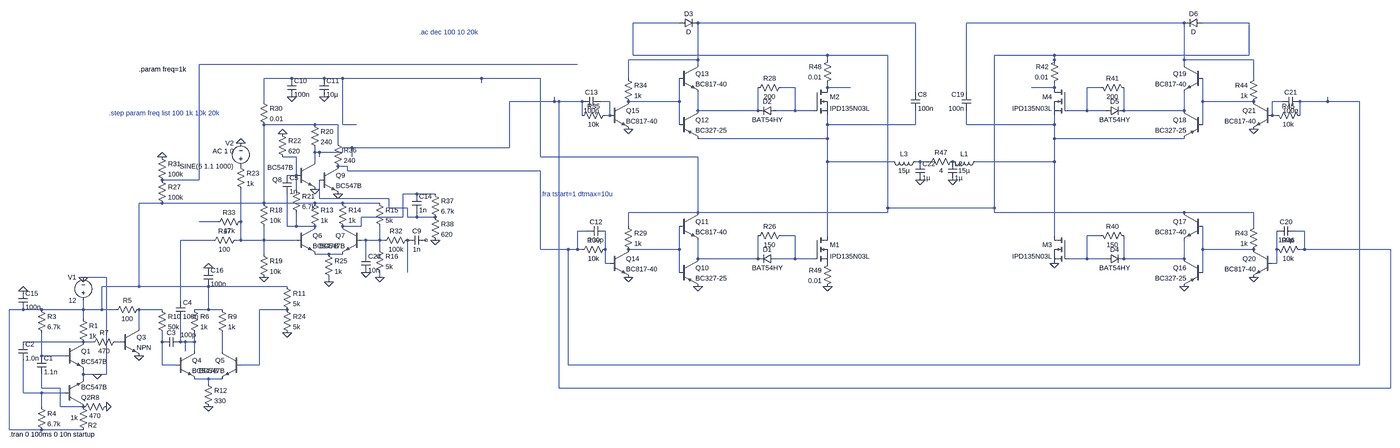
[diagram p0: schematic ClassDAmp.asc, whole sheet]
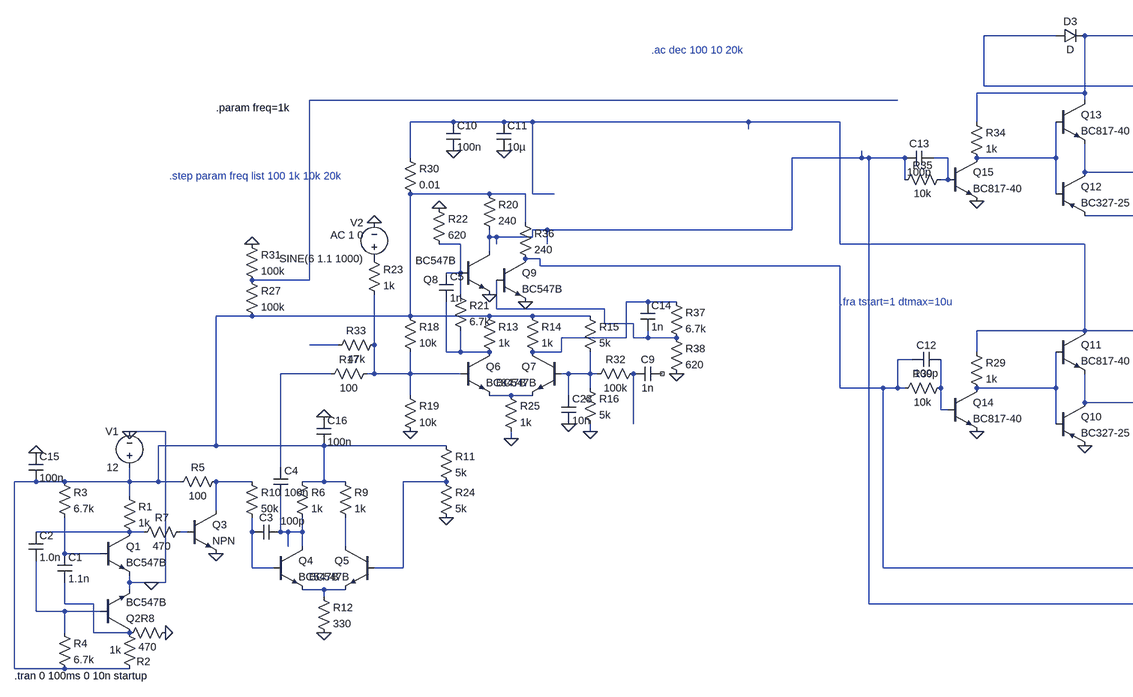
[diagram p1: schematic ClassDAmp.asc, part, row 1 of 1, column 1 of 2]
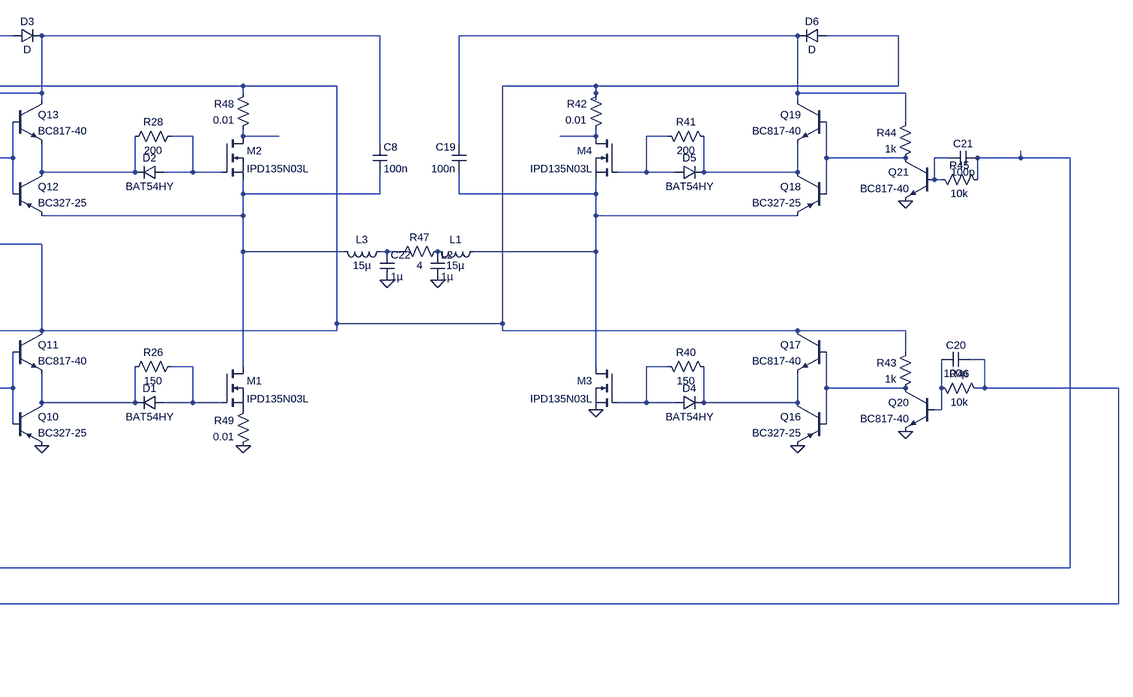
[diagram p2: schematic ClassDAmp.asc, part, row 1 of 1, column 2 of 2]
ClassDAmp.asc, the LTspice schematic file:
Version 4.1
SHEET 1 4820 680
WIRE 2160 -992 2000 -992
WIRE 2976 -992 2224 -992
WIRE 3904 -992 3152 -992
WIRE 4128 -992 3968 -992
WIRE 2000 -880 2000 -992
WIRE 2672 -880 2000 -880
WIRE 2880 -880 2672 -880
WIRE 3456 -880 3248 -880
WIRE 4128 -880 4128 -992
WIRE 4128 -880 3456 -880
WIRE 2224 -864 2224 -992
WIRE 2224 -864 1984 -864
WIRE 2672 -864 2672 -880
WIRE 3456 -864 3456 -880
WIRE 3904 -864 3904 -992
WIRE 4144 -864 3904 -864
WIRE 1808 -848 496 -848
WIRE 2224 -848 2224 -864
WIRE 3456 -848 3456 -864
WIRE 3904 -848 3904 -864
WIRE 816 -800 720 -800
WIRE 928 -800 816 -800
WIRE 992 -800 928 -800
WIRE 1472 -800 992 -800
WIRE 1680 -800 1472 -800
WIRE 1984 -800 1984 -864
WIRE 4144 -800 4144 -864
WIRE 1472 -784 1472 -800
WIRE 2560 -768 2512 -768
WIRE 2672 -768 2672 -784
WIRE 2752 -768 2672 -768
WIRE 3456 -768 3456 -784
WIRE 3456 -768 3376 -768
WIRE 3616 -768 3568 -768
WIRE 2976 -752 2976 -992
WIRE 3152 -752 3152 -992
WIRE 720 -720 720 -800
WIRE 1728 -720 1728 -736
WIRE 1728 -720 1568 -720
WIRE 1744 -720 1728 -720
WIRE 1824 -720 1744 -720
WIRE 1920 -720 1888 -720
WIRE 2160 -720 2160 -800
WIRE 2160 -720 1984 -720
WIRE 3968 -720 3968 -800
WIRE 4144 -720 3968 -720
WIRE 4240 -720 4208 -720
WIRE 4400 -720 4400 -736
WIRE 4400 -720 4304 -720
WIRE 4592 -720 4400 -720
WIRE 2224 -688 2224 -752
WIRE 2432 -688 2432 -768
WIRE 2432 -688 2224 -688
WIRE 2560 -688 2560 -768
WIRE 2560 -688 2496 -688
WIRE 2624 -688 2560 -688
WIRE 3568 -688 3568 -768
WIRE 3568 -688 3504 -688
WIRE 3632 -688 3568 -688
WIRE 3696 -688 3696 -768
WIRE 3904 -688 3904 -752
WIRE 3904 -688 3696 -688
WIRE 1824 -672 1824 -720
WIRE 1920 -672 1920 -720
WIRE 1920 -672 1904 -672
WIRE 4208 -672 4208 -720
WIRE 4224 -672 4208 -672
WIRE 4304 -672 4304 -720
WIRE 896 -640 720 -640
WIRE 976 -640 896 -640
WIRE 992 -640 992 -800
WIRE 1040 -640 992 -640
WIRE 2160 -640 2160 -720
WIRE 2672 -640 2672 -672
WIRE 2976 -640 2976 -688
WIRE 2976 -640 2672 -640
WIRE 3152 -640 3152 -688
WIRE 3456 -640 3456 -672
WIRE 3456 -640 3152 -640
WIRE 3968 -640 3968 -720
WIRE 2672 -592 2672 -640
WIRE 2672 -592 2224 -592
WIRE 3456 -592 3456 -640
WIRE 3904 -592 3456 -592
WIRE 976 -576 976 -640
WIRE 1024 -560 992 -560
WIRE 1568 -560 1568 -720
WIRE 1568 -560 1024 -560
WIRE 896 -544 896 -560
WIRE 912 -544 896 -544
WIRE 992 -544 992 -560
WIRE 992 -544 912 -544
WIRE 832 -528 784 -528
WIRE 912 -528 912 -544
WIRE 1024 -528 1024 -560
WIRE 1680 -528 1680 -800
WIRE 2224 -528 1680 -528
WIRE 896 -512 896 -544
WIRE 2672 -512 2672 -592
WIRE 2896 -512 2672 -512
WIRE 2992 -512 2976 -512
WIRE 3024 -512 2992 -512
WIRE 3456 -512 3456 -592
WIRE 3456 -512 3184 -512
WIRE 1008 -496 976 -496
WIRE 1008 -480 1008 -496
WIRE 1680 -480 1008 -480
WIRE 832 -464 832 -528
WIRE 832 -464 800 -464
WIRE 496 -448 496 -848
WIRE 496 -448 368 -448
WIRE 832 -416 832 -464
WIRE 1248 -400 1200 -400
WIRE 1312 -400 1248 -400
WIRE 912 -384 912 -448
WIRE 1152 -384 912 -384
WIRE 368 -368 288 -368
WIRE 720 -368 720 -640
WIRE 720 -368 368 -368
WIRE 896 -368 720 -368
WIRE 992 -368 896 -368
WIRE 1120 -368 992 -368
WIRE 1152 -352 1152 -384
WIRE 1216 -352 1152 -352
WIRE 2880 -352 2880 -880
WIRE 3248 -352 3248 -880
WIRE 3248 -352 2880 -352
WIRE 2224 -336 2224 -528
WIRE 2224 -336 1984 -336
WIRE 2880 -336 2880 -352
WIRE 2880 -336 2224 -336
WIRE 3248 -336 3248 -352
WIRE 3904 -336 3248 -336
WIRE 4144 -336 3904 -336
WIRE 1200 -320 1200 -400
WIRE 1200 -320 1056 -320
WIRE 1216 -320 1216 -352
WIRE 1248 -320 1248 -336
WIRE 1248 -320 1216 -320
WIRE 1312 -320 1248 -320
WIRE 560 -304 496 -304
WIRE 640 -304 640 -416
WIRE 800 -288 800 -400
WIRE 832 -288 832 -336
WIRE 832 -288 800 -288
WIRE 896 -288 832 -288
WIRE 1056 -288 1056 -320
WIRE 1056 -288 992 -288
WIRE 1984 -288 1984 -336
WIRE 4144 -288 4144 -336
WIRE 1840 -272 1808 -272
WIRE 4320 -272 4288 -272
WIRE 2560 -256 2512 -256
WIRE 2672 -256 2672 -512
WIRE 3456 -256 3456 -512
WIRE 3616 -256 3568 -256
WIRE 544 -240 432 -240
WIRE 640 -240 640 -304
WIRE 640 -240 624 -240
WIRE 720 -240 720 -288
WIRE 720 -240 640 -240
WIRE 832 -240 720 -240
WIRE 1072 -240 1056 -240
WIRE 1120 -240 1120 -288
WIRE 1120 -240 1072 -240
WIRE 1136 -240 1120 -240
WIRE 1120 -208 1120 -240
WIRE 1680 -208 1680 -480
WIRE 1776 -208 1680 -208
WIRE 1808 -208 1808 -272
WIRE 1808 -208 1776 -208
WIRE 1824 -208 1808 -208
WIRE 1904 -208 1904 -272
WIRE 2160 -208 2160 -288
WIRE 2160 -208 1984 -208
WIRE 3968 -208 3968 -288
WIRE 4144 -208 3968 -208
WIRE 4224 -208 4224 -272
WIRE 4320 -208 4320 -272
WIRE 4320 -208 4304 -208
WIRE 4816 -208 4320 -208
WIRE 720 -192 720 -240
WIRE 944 -192 896 -192
WIRE 992 -192 944 -192
WIRE 1072 -192 1072 -240
WIRE 2224 -176 2224 -240
WIRE 2432 -176 2432 -256
WIRE 2432 -176 2224 -176
WIRE 2560 -176 2560 -256
WIRE 2560 -176 2496 -176
WIRE 2624 -176 2560 -176
WIRE 3568 -176 3568 -256
WIRE 3568 -176 3504 -176
WIRE 3632 -176 3568 -176
WIRE 3696 -176 3696 -256
WIRE 3904 -176 3904 -240
WIRE 3904 -176 3696 -176
WIRE 1904 -160 1904 -208
WIRE 1920 -160 1904 -160
WIRE 4224 -160 4224 -208
WIRE 4224 -160 4208 -160
WIRE 1216 -128 1216 -240
WIRE 2160 -128 2160 -208
WIRE 3968 -128 3968 -208
WIRE 176 -112 96 -112
WIRE 1120 -112 1120 -128
WIRE 944 -96 944 -112
WIRE 288 -80 288 -368
WIRE 288 -80 160 -80
WIRE 528 -80 288 -80
WIRE 800 -80 528 -80
WIRE 432 -32 432 -240
WIRE -112 0 -160 0
WIRE -48 0 -112 0
WIRE 96 0 96 -32
WIRE 96 0 -48 0
WIRE 160 0 160 -80
WIRE 160 0 96 0
WIRE 208 0 160 0
WIRE 368 0 288 0
WIRE 528 0 528 -80
WIRE 528 0 480 0
WIRE 576 0 528 0
WIRE 800 0 704 0
WIRE 96 32 96 0
WIRE 288 64 288 0
WIRE 96 112 -112 112
WIRE 128 112 96 112
WIRE 224 112 208 112
WIRE 368 112 368 80
WIRE 432 112 432 32
WIRE 448 112 432 112
WIRE 480 112 480 80
WIRE 480 112 448 112
WIRE 448 144 448 112
WIRE 480 144 480 112
WIRE 576 144 576 80
WIRE -48 160 -48 80
WIRE 32 160 -48 160
WIRE 368 192 368 112
WIRE 416 192 368 192
WIRE 704 192 704 0
WIRE 704 192 640 192
WIRE 1776 192 1776 -208
WIRE 4592 192 4592 -720
WIRE 4592 192 1776 192
WIRE 96 224 96 208
WIRE 144 224 96 224
WIRE 176 224 176 -112
WIRE 176 224 144 224
WIRE 96 240 96 224
WIRE 528 240 480 240
WIRE 576 240 528 240
WIRE 528 256 528 240
WIRE -48 272 -48 224
WIRE 16 272 -48 272
WIRE 1744 272 1744 -720
WIRE 4816 272 4816 -208
WIRE 4816 272 1744 272
WIRE -112 288 -112 176
WIRE -48 288 -112 288
WIRE 32 288 -48 288
WIRE -48 336 -48 288
WIRE 16 336 16 272
WIRE 96 336 16 336
WIRE -160 416 -160 0
WIRE -48 416 -160 416
WIRE 96 416 -48 416
FLAG 96 -112 0
FLAG 144 224 0
FLAG 288 160 0
FLAG 176 336 0
FLAG 528 336 0
FLAG 720 -112 0
FLAG 896 -416 0
FLAG 784 -608 0
FLAG 640 -576 0
FLAG 1120 -112 0
FLAG 944 -96 0
FLAG 800 80 0
FLAG 368 -528 0
FLAG 816 -736 0
FLAG 928 -736 0
FLAG -112 -64 0
FLAG 528 -144 0
FLAG 976 -400 0
FLAG 1312 -240 0
FLAG 2224 -80 0
FLAG 2672 -80 0
FLAG 1984 -112 0
FLAG 1984 -624 0
FLAG 3904 -80 0
FLAG 3456 -160 0
FLAG 4144 -112 0
FLAG 4144 -624 0
FLAG 3104 -448 0
FLAG 2992 -448 0
FLAG 1072 -128 0
SYMBOL npn 32 112 R0
SYMATTR InstName Q1
SYMATTR Value BC547B
SYMBOL npn 32 336 M180
SYMATTR InstName Q2
SYMATTR Value BC547B
SYMBOL res 80 16 R0
SYMATTR InstName R1
SYMATTR Value 1k
SYMATTR SpiceLine tol=1 pwr=0.25
SYMBOL res 80 320 R0
WINDOW 0 32 80 Left 2
WINDOW 3 -28 54 Left 2
SYMATTR InstName R2
SYMATTR Value 1k
SYMATTR SpiceLine tol=1 pwr=0.25
SYMBOL voltage 96 -16 R180
WINDOW 0 24 96 Left 2
WINDOW 3 24 16 Left 2
WINDOW 123 0 0 Left 0
WINDOW 39 0 0 Left 0
SYMATTR InstName V1
SYMATTR Value 12
SYMBOL res -64 -16 R0
SYMATTR InstName R3
SYMATTR Value 6.7k
SYMATTR SpiceLine tol=1 pwr=0.25
SYMBOL res -64 320 R0
SYMATTR InstName R4
SYMATTR Value 6.7k
SYMATTR SpiceLine tol=1 pwr=0.25
SYMBOL cap -64 160 R0
SYMATTR InstName C1
SYMATTR Value 1.1n
SYMATTR SpiceLine Rser=600m
SYMBOL cap -128 112 R0
SYMATTR InstName C2
SYMATTR Value 1.0n
SYMATTR SpiceLine Rser=600m
SYMBOL npn 224 64 R0
SYMATTR InstName Q3
SYMBOL res 304 -16 R90
WINDOW 0 0 56 VBottom 2
WINDOW 3 32 56 VTop 2
SYMATTR InstName R5
SYMATTR Value 100
SYMATTR SpiceLine tol=1 pwr=0.25
SYMBOL res 224 96 R90
WINDOW 0 0 56 VBottom 2
WINDOW 3 32 56 VTop 2
SYMATTR InstName R7
SYMATTR Value 470
SYMATTR SpiceLine tol=1 pwr=0.25
SYMBOL res 192 320 R90
WINDOW 0 0 56 VBottom 2
WINDOW 3 32 56 VTop 2
SYMATTR InstName R8
SYMATTR Value 470
SYMATTR SpiceLine tol=1 pwr=0.25
SYMBOL npn 416 144 R0
SYMATTR InstName Q4
SYMATTR Value BC547B
SYMBOL npn 640 144 M0
SYMATTR InstName Q5
SYMATTR Value BC547B
SYMBOL res 464 -16 R0
SYMATTR InstName R6
SYMATTR Value 1k
SYMATTR SpiceLine tol=1 pwr=0.25
SYMBOL res 560 -16 R0
SYMATTR InstName R9
SYMATTR Value 1k
SYMATTR SpiceLine tol=1 pwr=0.25
SYMBOL res 352 -16 R0
SYMATTR InstName R10
SYMATTR Value 50k
SYMATTR SpiceLine tol=1 pwr=0.25
SYMBOL cap 432 96 R90
WINDOW 0 0 32 VBottom 2
WINDOW 3 -24 -27 VTop 2
SYMATTR InstName C3
SYMATTR Value 100p
SYMATTR SpiceLine V=100 Irms=364m Rser=0.268918 Lser=0
SYMBOL res 512 240 R0
SYMATTR InstName R12
SYMATTR Value 330
SYMATTR SpiceLine tol=1 pwr=0.25
SYMBOL cap 416 -32 R0
SYMATTR InstName C4
SYMATTR Value 100n
SYMBOL npn 832 -288 R0
SYMATTR InstName Q6
SYMATTR Value BC847B
SYMBOL npn 1056 -288 M0
SYMATTR InstName Q7
SYMATTR Value BC547B
SYMBOL res 880 -384 R0
SYMATTR InstName R13
SYMATTR Value 1k
SYMBOL res 976 -384 R0
SYMATTR InstName R14
SYMATTR Value 1k
SYMBOL res 1104 -384 R0
SYMATTR InstName R15
SYMATTR Value 5k
SYMBOL res 1104 -224 R0
SYMATTR InstName R16
SYMATTR Value 5k
SYMBOL res 640 -256 R90
WINDOW 0 0 56 VBottom 2
WINDOW 3 32 56 VTop 2
SYMATTR InstName R17
SYMATTR Value 100
SYMBOL res 704 -384 R0
SYMATTR InstName R18
SYMATTR Value 10k
SYMBOL res 704 -208 R0
SYMATTR InstName R19
SYMATTR Value 10k
SYMBOL npn 832 -512 R0
WINDOW 0 -83 63 Left 2
WINDOW 3 -100 20 Left 2
SYMATTR InstName Q8
SYMATTR Value BC547B
SYMBOL res 880 -656 R0
SYMATTR InstName R20
SYMATTR Value 240
SYMBOL res 816 -432 R0
SYMATTR InstName R21
SYMATTR Value 6.7k
SYMBOL res 768 -624 R0
SYMATTR InstName R22
SYMATTR Value 620
SYMBOL cap 784 -464 R0
SYMATTR InstName C5
SYMATTR Value 1n
SYMBOL voltage 640 -480 R180
WINDOW 0 24 96 Left 2
WINDOW 3 24 16 Left 2
WINDOW 123 24 68 Left 2
WINDOW 39 0 0 Left 0
SYMATTR InstName V2
SYMATTR Value SINE(6 1.1 1000)
SYMATTR Value2 AC 1 0
SYMBOL res 624 -512 R0
SYMATTR InstName R23
SYMATTR Value 1k
SYMBOL res 784 -96 R0
SYMATTR InstName R11
SYMATTR Value 5k
SYMBOL res 784 -16 R0
SYMATTR InstName R24
SYMATTR Value 5k
SYMBOL res 928 -208 R0
SYMATTR InstName R25
SYMATTR Value 1k
SYMBOL res 352 -464 R0
SYMATTR InstName R27
SYMATTR Value 100k
SYMBOL res 352 -544 R0
SYMATTR InstName R31
SYMATTR Value 100k
SYMBOL cap 1280 -256 R90
WINDOW 0 0 32 VBottom 2
WINDOW 3 32 32 VTop 2
SYMATTR InstName C9
SYMATTR Value 1n
SYMBOL res 1232 -256 R90
WINDOW 0 0 56 VBottom 2
WINDOW 3 32 56 VTop 2
SYMATTR InstName R32
SYMATTR Value 100k
SYMBOL cap 800 -800 R0
SYMATTR InstName C10
SYMATTR Value 100n
SYMBOL cap 912 -800 R0
SYMATTR InstName C11
SYMATTR Value 10µ
SYMBOL res 656 -320 R90
WINDOW 0 0 56 VBottom 2
WINDOW 3 32 56 VTop 2
SYMATTR InstName R33
SYMATTR Value 47k
SYMBOL res 704 -736 R0
SYMATTR InstName R30
SYMATTR Value 0.01
SYMBOL cap -128 -64 R0
SYMATTR InstName C15
SYMATTR Value 100n
SYMBOL cap 512 -144 R0
SYMATTR InstName C16
SYMATTR Value 100n
SYMBOL npn 912 -496 R0
SYMATTR InstName Q9
SYMATTR Value BC547B
SYMBOL res 960 -592 R0
SYMATTR InstName R36
SYMATTR Value 240
SYMBOL res 1296 -416 R0
SYMATTR InstName R37
SYMATTR Value 6.7k
SYMBOL res 1296 -336 R0
SYMATTR InstName R38
SYMATTR Value 620
SYMBOL cap 1232 -400 R0
SYMATTR InstName C14
SYMATTR Value 1n
SYMBOL diode 2496 -192 R90
WINDOW 0 0 32 VBottom 2
WINDOW 3 32 32 VTop 2
SYMATTR InstName D1
SYMATTR Value BAT54HY
SYMBOL res 2528 -272 R90
WINDOW 0 0 56 VBottom 2
WINDOW 3 32 56 VTop 2
SYMATTR InstName R26
SYMATTR Value 150
SYMBOL pnp 2160 -176 R0
SYMATTR InstName Q10
SYMATTR Value BC327-25
SYMBOL npn 2160 -336 R0
SYMATTR InstName Q11
SYMATTR Value BC817-40
SYMBOL nmos 2624 -256 R0
SYMATTR InstName M1
SYMATTR Value IPD135N03L
SYMBOL diode 2496 -704 R90
WINDOW 0 0 32 VBottom 2
WINDOW 3 32 32 VTop 2
SYMATTR InstName D2
SYMATTR Value BAT54HY
SYMBOL res 2528 -784 R90
WINDOW 0 0 56 VBottom 2
WINDOW 3 32 56 VTop 2
SYMATTR InstName R28
SYMATTR Value 200
SYMBOL pnp 2160 -688 R0
SYMATTR InstName Q12
SYMATTR Value BC327-25
SYMBOL npn 2160 -848 R0
SYMATTR InstName Q13
SYMATTR Value BC817-40
SYMBOL nmos 2624 -768 R0
SYMATTR InstName M2
SYMATTR Value IPD135N03L
SYMBOL cap 2960 -752 R0
SYMATTR InstName C8
SYMATTR Value 100n
SYMBOL diode 2160 -976 R270
WINDOW 0 32 32 VTop 2
WINDOW 3 0 32 VBottom 2
SYMATTR InstName D3
SYMBOL npn 1920 -208 R0
SYMATTR InstName Q14
SYMATTR Value BC817-40
SYMBOL res 1968 -304 R0
SYMATTR InstName R29
SYMATTR Value 1k
SYMBOL npn 1920 -720 R0
SYMATTR InstName Q15
SYMATTR Value BC817-40
SYMBOL res 1968 -816 R0
SYMATTR InstName R34
SYMATTR Value 1k
SYMBOL res 1920 -688 R90
WINDOW 0 0 56 VBottom 2
WINDOW 3 32 56 VTop 2
SYMATTR InstName R35
SYMATTR Value 10k
SYMBOL res 1920 -224 R90
WINDOW 0 0 56 VBottom 2
WINDOW 3 32 56 VTop 2
SYMATTR InstName R39
SYMATTR Value 10k
SYMBOL cap 1904 -288 R90
WINDOW 0 0 32 VBottom 2
WINDOW 3 32 32 VTop 2
SYMATTR InstName C12
SYMATTR Value 100p
SYMBOL cap 1888 -736 R90
WINDOW 0 0 32 VBottom 2
WINDOW 3 32 32 VTop 2
SYMATTR InstName C13
SYMATTR Value 100p
SYMBOL diode 3632 -192 M90
WINDOW 0 0 32 VBottom 2
WINDOW 3 32 32 VTop 2
SYMATTR InstName D4
SYMATTR Value BAT54HY
SYMBOL res 3600 -272 M90
WINDOW 0 0 56 VBottom 2
WINDOW 3 32 56 VTop 2
SYMATTR InstName R40
SYMATTR Value 150
SYMBOL pnp 3968 -176 M0
SYMATTR InstName Q16
SYMATTR Value BC327-25
SYMBOL npn 3968 -336 M0
SYMATTR InstName Q17
SYMATTR Value BC817-40
SYMBOL nmos 3504 -256 M0
SYMATTR InstName M3
SYMATTR Value IPD135N03L
SYMBOL diode 3632 -704 M90
WINDOW 0 0 32 VBottom 2
WINDOW 3 32 32 VTop 2
SYMATTR InstName D5
SYMATTR Value BAT54HY
SYMBOL res 3600 -784 M90
WINDOW 0 0 56 VBottom 2
WINDOW 3 32 56 VTop 2
SYMATTR InstName R41
SYMATTR Value 200
SYMBOL pnp 3968 -688 M0
SYMATTR InstName Q18
SYMATTR Value BC327-25
SYMBOL npn 3968 -848 M0
SYMATTR InstName Q19
SYMATTR Value BC817-40
SYMBOL nmos 3504 -768 M0
SYMATTR InstName M4
SYMATTR Value IPD135N03L
SYMBOL res 3472 -880 M0
SYMATTR InstName R42
SYMATTR Value 0.01
SYMBOL cap 3168 -752 M0
SYMATTR InstName C19
SYMATTR Value 100n
SYMBOL diode 3968 -976 M270
WINDOW 0 32 32 VTop 2
WINDOW 3 0 32 VBottom 2
SYMATTR InstName D6
SYMBOL npn 4208 -208 M0
SYMATTR InstName Q20
SYMATTR Value BC817-40
SYMBOL res 4160 -304 M0
SYMATTR InstName R43
SYMATTR Value 1k
SYMBOL npn 4208 -720 M0
SYMATTR InstName Q21
SYMATTR Value BC817-40
SYMBOL res 4160 -816 M0
SYMATTR InstName R44
SYMATTR Value 1k
SYMBOL res 4208 -688 M90
WINDOW 0 0 56 VBottom 2
WINDOW 3 32 56 VTop 2
SYMATTR InstName R45
SYMATTR Value 10k
SYMBOL res 4208 -224 M90
WINDOW 0 0 56 VBottom 2
WINDOW 3 32 56 VTop 2
SYMATTR InstName R46
SYMATTR Value 10k
SYMBOL cap 4224 -288 M90
WINDOW 0 0 32 VBottom 2
WINDOW 3 32 32 VTop 2
SYMATTR InstName C20
SYMATTR Value 100p
SYMBOL cap 4240 -736 M90
WINDOW 0 0 32 VBottom 2
WINDOW 3 32 32 VTop 2
SYMATTR InstName C21
SYMATTR Value 100p
SYMBOL res 3120 -528 R90
WINDOW 0 0 56 VBottom 2
WINDOW 3 32 56 VTop 2
SYMATTR InstName R47
SYMATTR Value 4
SYMBOL res 2688 -880 M0
SYMATTR InstName R48
SYMATTR Value 0.01
SYMBOL ind 3200 -528 R90
WINDOW 0 5 56 VBottom 2
WINDOW 3 32 56 VTop 2
SYMATTR InstName L1
SYMATTR Value 15µ
SYMBOL cap 3088 -512 R0
SYMATTR InstName L2
SYMATTR Value 1µ
SYMBOL ind 2992 -528 R90
WINDOW 0 5 56 VBottom 2
WINDOW 3 32 56 VTop 2
SYMATTR InstName L3
SYMATTR Value 15µ
SYMBOL cap 2976 -512 R0
SYMATTR InstName C22
SYMATTR Value 1µ
SYMBOL cap 1056 -192 R0
SYMATTR InstName C23
SYMATTR Value 10n
SYMBOL res 2688 -176 M0
SYMATTR InstName R49
SYMATTR Value 0.01
TEXT -160 432 Left 2 !.tran 0 100ms 0 10n startup
TEXT 1680 -400 Left 2 ;.fra tstart=1 dtmax=10u
TEXT 1256 -960 Left 2 ;.ac dec 100 10 20k
TEXT 184 -680 Left 2 ;.step param freq list 100 1k 10k 20k
TEXT 288 -832 Left 2 !.param freq=1k

The netlist it stands for:
* ClassDAmp.asc
Q1 N041 N046 0 0 BC547B
Q2 N048 N049 0 0 BC547B
R1 N017 N041 1k tol=1 pwr=0.25
R2 N048 N017 1k tol=1 pwr=0.25
V1 N017 0 12
R3 N017 N046 6.7k tol=1 pwr=0.25
R4 N049 N017 6.7k tol=1 pwr=0.25
C1 N046 N048 1.1n Rser=600m
C2 N041 N049 1.0n Rser=600m
Q3 N039 N042 0 0 NPN
R5 N039 N017 100 tol=1 pwr=0.25
R7 N042 N041 470 tol=1 pwr=0.25
R8 0 N048 470 tol=1 pwr=0.25
Q4 N044 N043 N047 0 BC547B
Q5 N045 N040 N047 0 BC547B
R6 N017 N044 1k tol=1 pwr=0.25
R9 N017 N045 1k tol=1 pwr=0.25
R10 N039 N043 50k tol=1 pwr=0.25
C3 N044 N043 100p V=100 Irms=364m Rser=0.268918 Lser=0
R12 N047 0 330 tol=1 pwr=0.25
C4 N029 N044 100n
Q6 N026 N025 N035 0 BC847B
Q7 N022 N030 N035 0 BC547B
R13 N017 N026 1k
R14 N017 N022 1k
R15 N017 N030 5k
R16 N030 0 5k
R17 N025 N029 100
R18 N017 N025 10k
R19 N025 0 10k
Q8 N009 N020 0 0 BC547B
R20 N017 N009 240
R21 N020 N026 6.7k
R22 0 N020 620
C5 N020 N026 1n
V2 P001 0 SINE(6 1.1 1000) AC 1 0
R23 P001 N025 1k
R11 N017 N040 5k
R24 N040 0 5k
R25 N035 0 1k
R27 N004 N017 100k
R31 0 N004 100k
C9 NC_01 N038 1n
R32 N038 N030 100k
C10 N001 0 100n
C11 N001 0 10µ
R33 N025 N024 47k
R30 N001 N017 0.01
C15 0 N017 100n
C16 0 N017 100n
Q9 N014 N023 0 0 BC547B
R36 N017 N014 240
R37 N022 N023 6.7k
R38 N023 0 620
C14 N022 N023 1n
D1 N027 N036 BAT54HY
R26 N027 N036 150
Q10 N036 N032 0 0 BC327-25
Q11 N001 N032 N036 0 BC817-40
M1 N018 N027 P002 P002 IPD135N03L
D2 N005 N015 BAT54HY
R28 N005 N015 200
Q12 N015 N011 N018 0 BC327-25
Q13 N002 N011 N015 0 BC817-40
M2 N006 N005 N018 N018 IPD135N03L
C8 N002 N018 100n
D3 N001 N002 D
Q14 N032 N031 0 0 BC817-40
R29 N001 N032 1k
Q15 N011 N010 0 0 BC817-40
R34 N002 N011 1k
R35 N010 N009 10k
R39 N031 N014 10k
C12 N031 N014 100p
C13 N010 N009 100p
D4 N028 N037 BAT54HY
R40 N028 N037 150
Q16 N037 N033 0 0 BC327-25
Q17 N001 N033 N037 0 BC817-40
M3 N019 N028 0 0 IPD135N03L
D5 N008 N016 BAT54HY
R41 N008 N016 200
Q18 N016 N012 N019 0 BC327-25
Q19 N003 N012 N016 0 BC817-40
M4 N007 N008 N019 N019 IPD135N03L
R42 N001 N007 0.01
C19 N003 N019 100n
D6 N001 N003 D
Q20 N033 N034 0 0 BC817-40
R43 N001 N033 1k
Q21 N012 N013 0 0 BC817-40
R44 N003 N012 1k
R45 N013 N014 10k
R46 N034 N009 10k
C20 N034 N009 100p
C21 N013 N014 100p
R47 P003 N021 4
R48 N001 N006 0.01
L1 N019 P003 15µ
C§L2 P003 0 1µ
L3 N021 N018 15µ
C22 N021 0 1µ
C23 N030 0 10n
R49 P002 0 0.01
.model D D
.lib standard.dio
.model NPN NPN
.model PNP PNP
.lib standard.bjt
.model NMOS NMOS
.model PMOS PMOS
.lib standard.mos
.tran 0 100ms 0 10n startup
* .fra tstart=1 dtmax=10u
* .ac dec 100 10 20k
* .step param freq list 100 1k 10k 20k
.param freq=1k
.backanno
.end